# Altium schematic sheet MAX M10S.SchDoc
size A; SheetNumber: 9; SheetTotal: 14
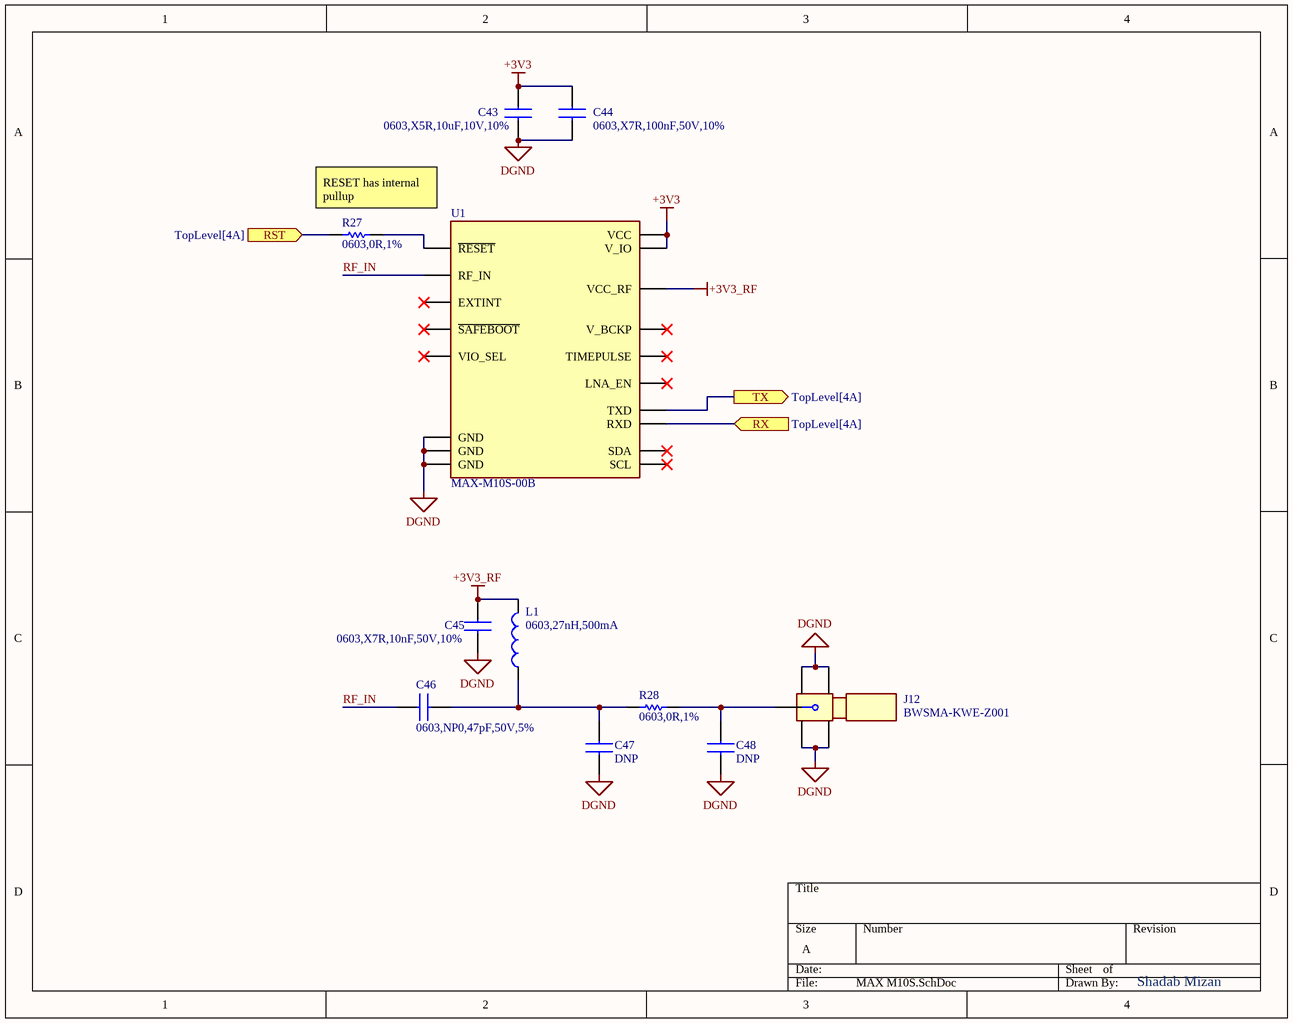
[diagram p0: MAX M10S.SchDoc]

## Parts
C43  0603,X5R,10uF,10V,10%  [CAPC1608X90N]
C44  0603,X7R,100nF,50V,10%  [CAPC1608X90N]
C45  0603,X7R,10nF,50V,10%  [CAPC1608X90N]
C46  0603,NP0,47pF,50V,5%  [CAPC1608X90N]
C47  DNP  [CAPC1608X90N]
C48  DNP  [CAPC1608X90N]
J12  BWSMA-KWE-Z001  [SMA-TH_BWSMA-KWE-Z001]
L1  0603,27nH,500mA  [INDC1608X90N]
R27  0603,0R,1%  [RESC1608X90N]
R28  0603,0R,1%  [RESC1608X90N]
U1  MAX-M10S-00B  [XCVR_MAX-M10S-00B]

## Ports
RST (in, see TopLevel[4A]), RX (in, see TopLevel[4A]), TX (out, see TopLevel[4A])

## Nets
+3V3: C43.2 C44.2 U1.7(V_IO) U1.8(VCC)
+3V3_RF: C45.2 L1.2 U1.14(VCC_RF)
DGND: C43.1 C44.1 C45.1 C47.1 C48.1 J12.1 J12.2 J12.3 J12.4 U1.1(GND) U1.10(GND) U1.12(GND)
RF_IN: C46.1 U1.11(RF_IN)
RST: R27.1 ; port RST
RX: U1.3(RXD) ; port RX
TX: U1.2(TXD) ; port TX
NetC46_2: C46.2 C47.2 L1.1 R28.1
NetC48_2: C48.2 J12.5 R28.2
NetR27_2: R27.2 U1.9(~{RESET})

Not connected (* = marked no-connect by the designer): U1 4(TIMEPULSE)* 5(EXTINT)* 6(V_BCKP)* 13(LNA_EN)* 15(VIO_SEL)* 16(SDA)* 17(SCL)* 18(~{SAFEBOOT})*

## Notes on the sheet
- RESET has internal pullup
- Shadab Mizan

## Library data of the parts
C43 = CL10A106KP8NNNC: 10uF ±10% 10V Ceramic Capacitor X5R 0603; LCSC Part #: C19702; Manu Part #: CL10A106KP8NNNC
C44 = CC0603KRX7R9BB104: 50V 100nF X7R ±10% 0603 Multilayer Ceramic Capacitors MLCC - SMD/SMT ROHS; LCSC Part #: C14663; Manu Part #: CC0603KRX7R9BB104
C45 = 0603B103K500NT: 10nF ±10% 50V Ceramic Capacitor X7R 0603; LCSC Part #: C57112; Manu Part #: 0603B103K500NT
C46 = CL10C470JB8NNNC: 47 pF ±5% 50V Ceramic Capacitor C0G, NP0 0603 (1608 Metric); Manu Part #: CL10C470JB8NNNC; LCSC Part #: C1671
C47 C48 = CC0603KRX7R9BB103: 10nF ±10% 50V Ceramic Capacitor X7R 0603; LCSC Part #: C100042; Manu Part #: CC0603KRX7R9BB103
J12 = BWSMA-KWE-Z001: Connector Receptacle SMA Female Pin 50Ω Through Hole Right Angle; Manu Part #: BWSMA-KWE-Z001; LCSC Part #: C496551
L1 = LQG18HN27NJ00D: 27 nH Unshielded Multilayer Inductor 500 mA 550mOhm Max 0603 (1608 Metric); Manu Part #: LQG18HN27NJ00D; LCSC Part #: C162550
R27 R28 = 0603WAF0000T5E: 0Ω 100mW 75V Thick Film Resistor ±1% 0603 Chip Resistor - Surface Mount RoHS; LCSC Part #: C21189; Manu Part #: 0603WAF0000T5E
U1 = MAX-M10S-00B: Standard precision GNSS module; Manu Part #: MAX-M10S-00B; LCSC Part #: C4153167